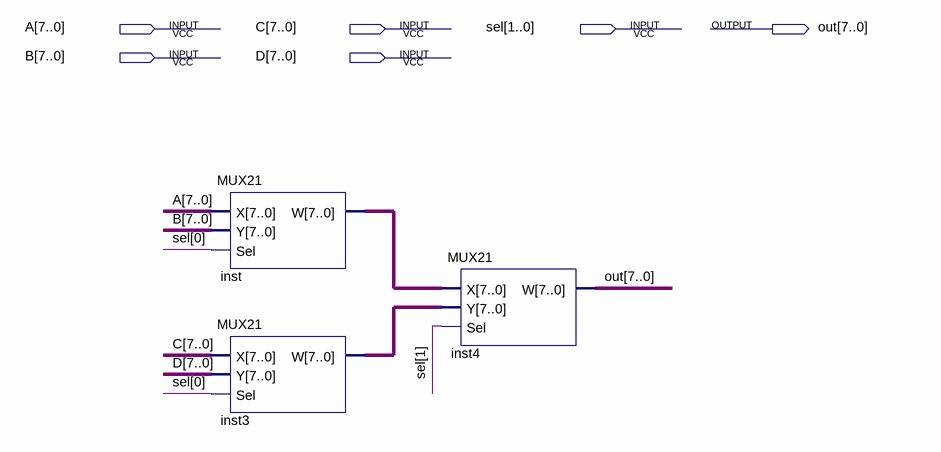
[diagram p0: schematic sheet]
// Quartus schematic MUX41.bdf as structural Verilog: 3 symbols, 6 pins
module MUX41 (
  input  [7:0] A,
  input  [7:0] C,
  input  [1:0] sel,
  input  [7:0] B,
  input  [7:0] D,
  output [7:0] out
);

  wire [7:0] inst3_w, inst_w;

  MUX21 inst (.X(A), .Y(B), .Sel(sel[0]), .W(inst_w));
  MUX21 inst3 (.X(C), .Y(D), .Sel(sel[0]), .W(inst3_w));
  MUX21 inst4 (.X(inst_w), .Y(inst3_w), .Sel(sel[1]), .W(out));
endmodule
